# EAGLE design ir_remote_v3 (EAGLE 9.6.2)
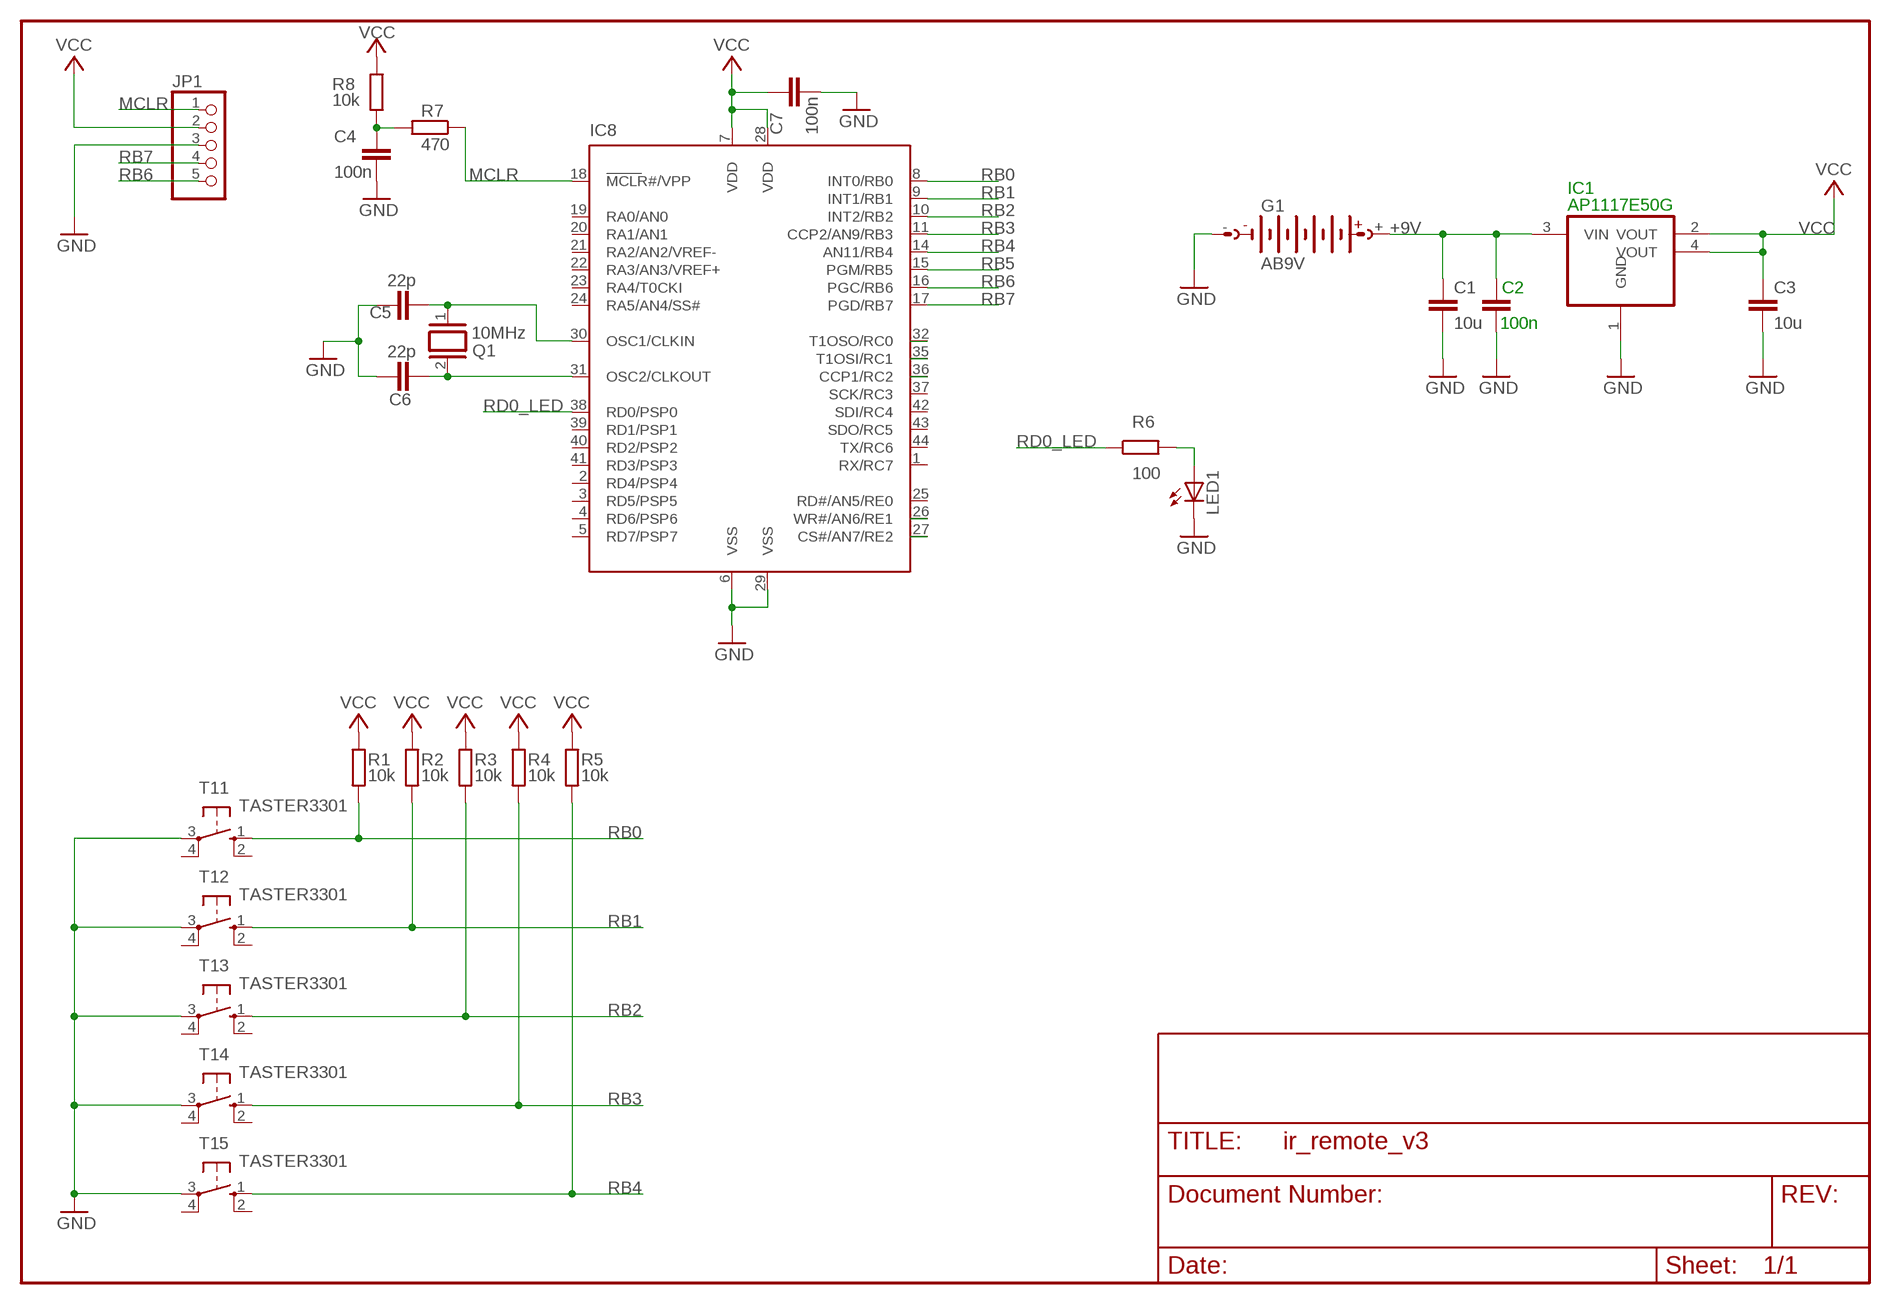
[diagram p0: schematic, sheet 1]

## Parts
C1  10u  C-EUC0805  [C0805]
C2  100n  C-EUC0805  [C0805]
C3  10u  C-EUC0805  [C0805]
C4  100n  C-EUC0805  [C0805]
C5  22p  C-EUC0603_WE  [C0603_WE]
C6  22p  C-EUC0603_WE  [C0603_WE]
C7  100n  C-EUC0805  [C0805]
G1  AB9V  [AB9V]
IC1  AP1117E50G  REG1117-2OUT  [SOT223]
IC8  PIC18F4520  [TQFP44]
JP1  PINHD-1X5  [1X05]
LED1  LED5MM  [LED5MM]
Q1  10MHz  XTAL_HC5032  [QUARZ_HC5032/2]
R1  10k  R-EU_M0805  [M0805]
R2  10k  R-EU_M0805  [M0805]
R3  10k  R-EU_M0805  [M0805]
R4  10k  R-EU_M0805  [M0805]
R5  10k  R-EU_M0805  [M0805]
R6  100  R-EU_M0805  [M0805]
R7  470  R-EU_M0805  [M0805]
R8  10k  R-EU_M0805  [M0805]
T11  TASTER3301  [TASTER3301]
T12  TASTER3301  [TASTER3301]
T13  TASTER3301  [TASTER3301]
T14  TASTER3301  [TASTER3301]
T15  TASTER3301  [TASTER3301]

## Nets
+9V: C1.1 C2.1 G1.+ IC1.3(VIN)
D0_LCD: IC8.27(CS#/AN7/RE2)
D1_LCD: IC8.26(WR#/AN6/RE1)
GND: C1.2 C2.2 C3.2 C4.2 C5.1 C6.1 C7.2 G1.- IC1.1(GND) IC8.6(VSS) IC8.29(VSS) JP1.3 LED1.K(C) T11.3(P) T12.3(P) T13.3(P) T14.3(P) T15.3(P)
MCLR: IC8.18(MCLR#/VPP) JP1.1 R7.1
N$19: LED1.A R6.2
N$24: C4.1 R7.2 R8.2
N$47: C5.2 IC8.30(OSC1/CLKIN) Q1.1
N$48: C6.2 IC8.31(OSC2/CLKOUT) Q1.2
RB0: IC8.8(INT0/RB0) R1.2 T11.1(S)
RB1: IC8.9(INT1/RB1) IC8.35(T1OSI/RC1) R2.2 T12.1(S)
RB2: IC8.10(INT2/RB2) IC8.32(T1OSO/RC0) R3.2 T13.1(S)
RB3: IC8.11(CCP2/AN9/RB3) R4.2 T14.1(S)
RB4: IC8.14(AN11/RB4) R5.2 T15.1(S)
RB5: IC8.15(PGM/RB5)
RB6: IC8.16(PGC/RB6) JP1.5
RB7: IC8.17(PGD/RB7) JP1.4
RD0_LED: IC8.38(RD0/PSP0) R6.1
RDS_INT: IC8.36(CCP1/RC2)
VCC: C3.1 C7.1 IC1.2(VOUT) IC1.4(VOUT) IC8.7(VDD) IC8.28(VDD) JP1.2 R1.1 R2.1 R3.1 R4.1 R5.1 R8.1
Unconnected: IC8.1(RX/RC7) IC8.2(RD4/PSP4) IC8.3(RD5/PSP5) IC8.4(RD6/PSP6) IC8.5(RD7/PSP7) IC8.19(RA0/AN0) IC8.20(RA1/AN1) IC8.21(RA2/AN2/VREF-) IC8.22(RA3/AN3/VREF+) IC8.23(RA4/T0CKI) IC8.24(RA5/AN4/SS#) IC8.25(RD#/AN5/RE0) IC8.37(SCK/RC3) IC8.39(RD1/PSP1) IC8.40(RD2/PSP2) IC8.41(RD3/PSP3) IC8.42(SDI/RC4) IC8.43(SDO/RC5) IC8.44(TX/RC6) T11.2(S1) T11.4(P1) T12.2(S1) T12.4(P1) T13.2(S1) T13.4(P1) T14.2(S1) T14.4(P1) T15.2(S1) T15.4(P1)

## Library data of the parts
C1 C3-C7 = rcl:C-EU: CAPACITOR, European symbol
C2 = rcl_416:C-EU: CAPACITOR, European symbol
G1 = battery:AB9V: 9-V BATTERY CLIP
IC1 = Bernd_110428:REG1117-2OUT: 800mA and 1A Low Dropout (LDO) Positive Regulator 1.8V, 2.5V, 2.85V, 3.3V, 5V, and Adj
IC8 = Bernd:PIC18F4520
JP1 = pinhead:PINHD-1X5: PIN HEADER
LED1 = led:LED: LED OSRAM: - CHIPLED LG R971, LG N971, LY N971, LG Q971, LY Q971, LO R971, LY R971 LH N974, LH R974 LS Q976, LO Q976, LY Q976 LO Q996 - Hyper CHIPLED LW Q18S LB Q993, LB Q99A, LB R99A - SideLED LS A670, LO A670, LY A670, LG A670, LP A670 LB A673, LV A673, LT A673, LW A673 LH A674 LY A675 LS A676, LA A676, LO A676, LY A676, LW A676 LS A679, LY A679, LG A679 - Hyper Micro SIDELED® LS Y876, LA Y876, LO Y876, LY Y876 LT Y87S - SmartLED LW L88C, LW L88S LB L89C, LB L89S, LG L890 LS L89K, LO L89K, LY L89K LS L896, LA L896, LO L896, LY L896 - TOPLED LS T670, LO T670, LY T670, LG T670, LP T670 LSG T670, LSP T670, LSY T670, LOP T670, LYG T670 LG T671, LOG T671, LSG T671 LB T673, LV T673, LT T673, LW T673 LH T674 LS T676, LA T676, LO T676, LY T676, LB T676, LH T676, LSB T676, LW T676 LB T67C, LV T67C, LT T67C, LS T67K, LO T67K, LY T67K, LW E67C LS E67B, LA E67B, LO E67B, LY E67B, LB E67C, LV E67C, LT E67C LW T67C LS T679, LY T679, LG T679 LS T770, LO T770, LY T770, LG T770, LP T770 LB T773, LV T773, LT T773, LW T773 LH T774 LS E675, LA E675, LY E675, LS T675 LS T776, LA T776, LO T776, LY T776, LB T776 LHGB T686 LT T68C, LB T68C - Hyper Mini TOPLED® LB M676 - Mini TOPLED Santana® LG M470 LS M47K, LO M47K, LY M47K Source: http://www.osram.convergy.de LUXEON: - LUMILED® LXK2-PW12-R00, LXK2-PW12-S00, LXK2-PW14-U00, LXK2-PW14-V00 LXK2-PM12-R00, LXK2-PM12-S00, LXK2-PM14-U00 LXK2-PE12-Q00, LXK2-PE12-R00, LXK2-PE12-S00, LXK2-PE14-T00, LXK2-PE14-U00 LXK2-PB12-K00, LXK2-PB12-L00, LXK2-PB12-M00, LXK2-PB14-N00, LXK2-PB14-P00, LXK2-PB14-Q00 LXK2-PR12-L00, LXK2-PR12-M00, LXK2-PR14-Q00, LXK2-PR14-R00 LXK2-PD12-Q00, LXK2-PD12-R00, LXK2-PD12-S00 LXK2-PH12-R00, LXK2-PH12-S00 LXK2-PL12-P00, LXK2-PL12-Q00, LXK2-PL12-R00 Source: www.luxeon.com KINGBRIGHT: KA-3528ASYC Source: www.kingbright.com
Q1 = Bernd:XTAL: 9HT10-32.768KDZF-T RS: 753-7265P Farnell: 2061724
R1-R8 = rcl:R-EU_: RESISTOR, European symbol
T11-T15 = Bernd:TASTER3301

## Board
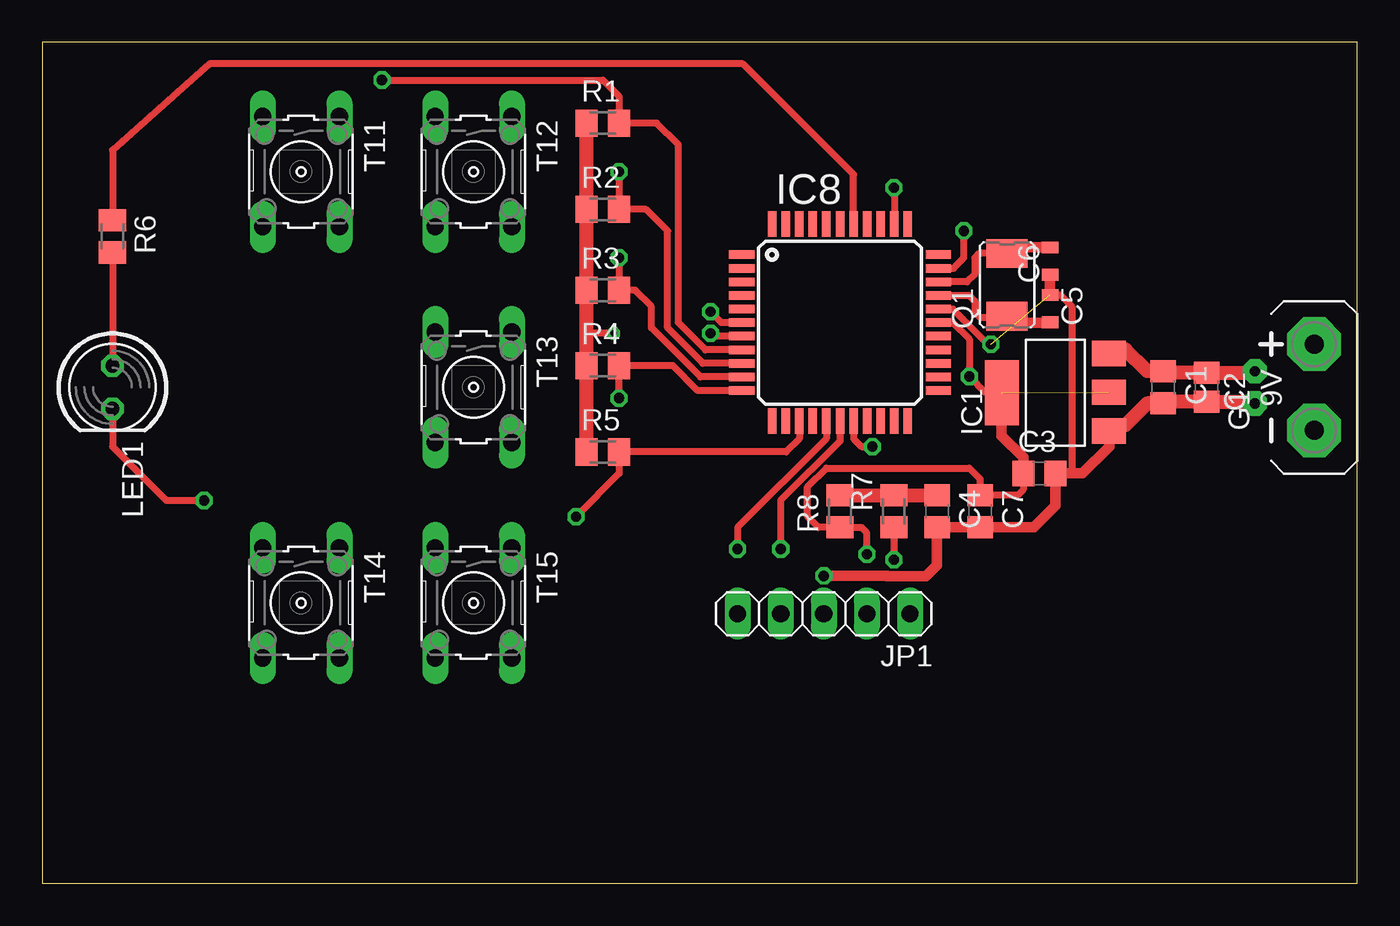
[diagram p1: board, top side]
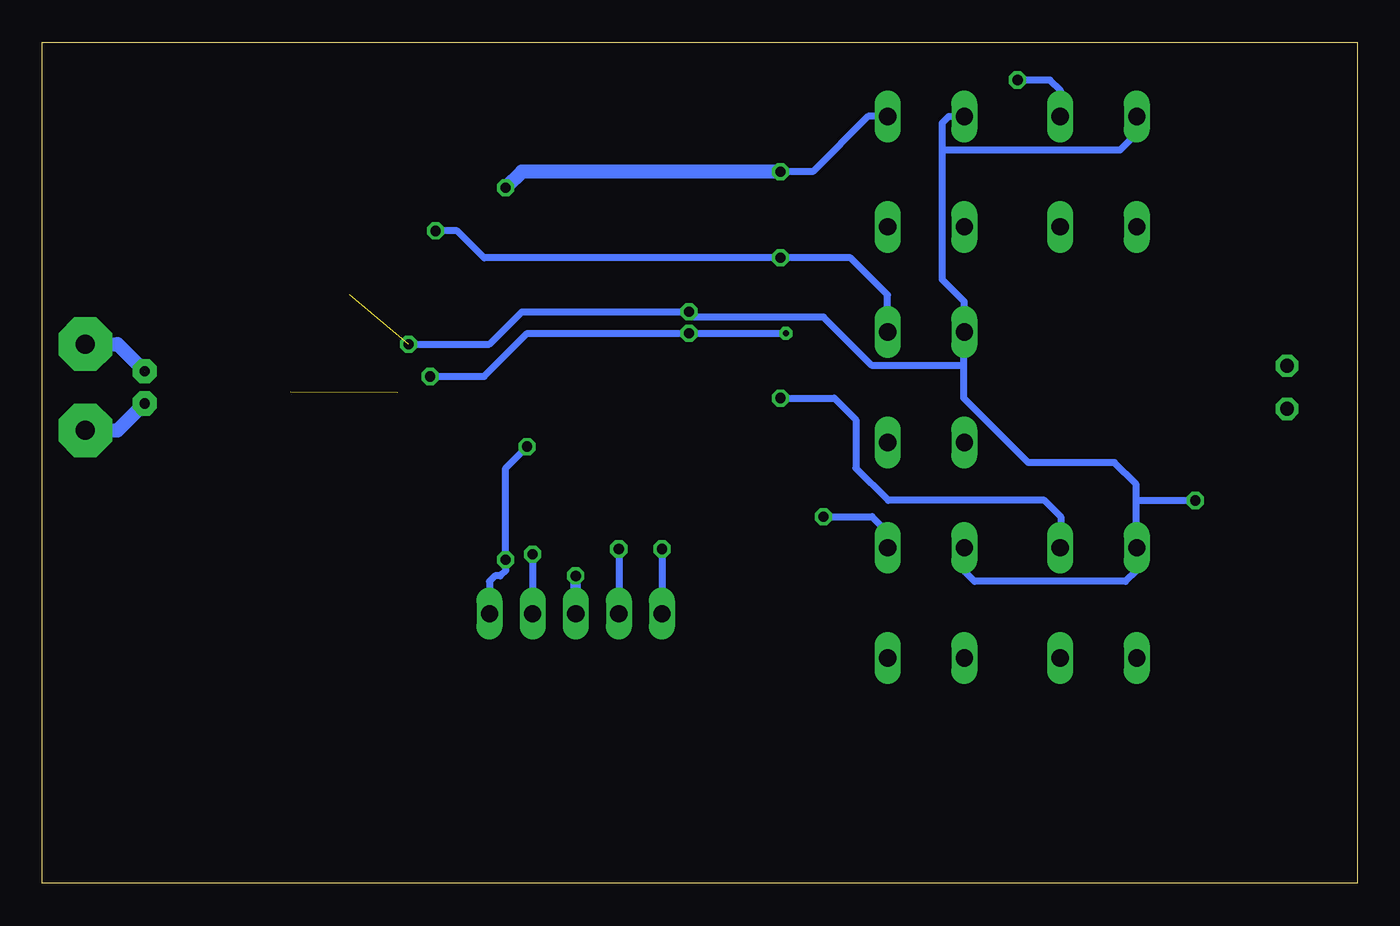
[diagram p2: board, bottom side, seen from below]

Size 77.46 x 49.52 mm. Coordinates in mm from the lower left corner, seen from the top.
Outline: 0,0 77.46,0 77.46,49.52 0,49.52 0,0
Copper layers (1*16): Top 0.035mm / dielectric 1.5mm / Bottom 0.035mm
Design rules "default": minimum track width 6mil, minimum drill 0.35mm, track to track 6mil, track to pad 6mil, pad to pad 6mil, via to via 6mil, smd to smd 6mil, copper to edge 40mil, drill to drill 6mil, minimum pad ring 10mil, minimum via ring 8mil, stop-mask expansion 4mil, vias tented up to drill 0mil, thermal gap 10mil

### Footprints (pad centres in the part's own frame; a part is rotated, then mirrored left to right if it is on the bottom)
C0805 = smd 1.3 x 1.5: 1 -0.95,0; 2 0.95,0
C0805' = smd 1.3 x 1.5: 1 -0.85,0; 2 0.85,0
C0603_WE = smd 0.7 x 1: 1 -0.8,0; 2 0.8,0
AB9V = drill 1.118 pad 3.15 octagon: + 0,2.54; - 0,-2.54
SOT223 = smd 1.499 x 2.007: 1 -2.261,-3.15; 2 0.025,-3.15; 3 2.311,-3.15 | smd 3.81 x 2.007: 4 0,3.15
TQFP44 = smd 1.5 x 0.5: 1 -5.8,4; 2 -5.8,3.2; 3 -5.8,2.4; 4 -5.8,1.6; 5 -5.8,0.8; 6 -5.8,0; 7 -5.8,-0.8; 8 -5.8,-1.6; 9 -5.8,-2.4; 10 -5.8,-3.2; 11 -5.8,-4; 23 5.8,-4; 24 5.8,-3.2; 25 5.8,-2.4; 26 5.8,-1.6; 27 5.8,-0.8; 28 5.8,0; 29 5.8,0.8; 30 5.8,1.6; 31 5.8,2.4; 32 5.8,3.2; 33 5.8,4 | smd 0.5 x 1.5: 12 -4,-5.8; 13 -3.2,-5.8; 14 -2.4,-5.8; 15 -1.6,-5.8; 16 -0.8,-5.8; 17 0,-5.8; 18 0.8,-5.8; 19 1.6,-5.8; 20 2.4,-5.8; 21 3.2,-5.8; 22 4,-5.8; 34 4,5.8; 35 3.2,5.8; 36 2.4,5.8; 37 1.6,5.8; 38 0.8,5.8; 39 0,5.8; 40 -0.8,5.8; 41 -1.6,5.8; 42 -2.4,5.8; 43 -3.2,5.8; 44 -4,5.8
1X05 = drill 1.016 long: 1 -5.08,0; 2 -2.54,0; 3 0,0; 4 2.54,0; 5 5.08,0
LED5MM = drill 0.813 octagon: A -1.27,0; K 1.27,0
QUARZ_HC5032/2 = smd 1.7 x 2.4: 1 -1.85,0; 2 1.85,0
M0805 = smd 1.3 x 1.6: 1 -0.95,0; 2 0.95,0
TASTER3301 = drill 1.016 long: 1 -3.251,2.261; 2 3.251,2.261; 3 -3.251,-2.261; 4 3.251,-2.261

### Placement (x,y rotation side)
C1  66.04,29.21 270 top
C2  100n  [C0805']  68.58,29.21 270 top
C3  58.74,24.13 0 top
C4  52.7,21.91 270 top
C5  59.37,33.85 270 top
C6  59.37,36.64 90 top
C7  55.24,21.91 270 top
G1  74.93,29.21 0 top
IC1  59.69,28.89 90 top
IC8  46.99,33.02 0 top
JP1  46.04,15.88 180 top
LED1  4.13,29.21 270 top
Q1  56.83,35.24 90 top
R1  33.02,44.77 0 top
R2  33.02,39.69 0 top
R3  33.02,34.92 0 top
R4  33.02,30.48 0 top
R5  33.02,25.4 0 top
R6  4.13,38.1 270 top
R7  50.16,21.91 90 top
R8  46.99,21.91 90 top
T11  15.24,41.91 270 top
T12  25.4,41.91 270 top
T13  25.4,29.21 270 top
T14  15.24,16.51 270 top
T15  25.4,16.51 270 top

### Tracks (layer width: path | path; a pad name or v marks a point on that pad's centre or on a via)
+9V  (1 unrouted)
  Top 0.813: 71.44,30.16 71.33,30.06 C2.1 66.14,30.06 C1.1 65.09,30.16 63.82,31.43 63.07,31.43 IC1.3
  Bottom 0.813: G1.+ 73.03,31.75 71.44,30.16
GND  (via drill 0.6, 0.6 pad 1.42)  (1 unrouted)
  Top 0.406: C5.1 59.97,34.65 60.64,33.97 60.64,24.13 | C3.2 | LED1.K 4.13,25.72 7.3,22.54 v9.53,22.54 | IC8.6 40.01,33.02 v39.37,33.66 | v55.88,31.75 55.72,31.75 53.65,33.82 IC8.29
  Top 0.61: C6.1 C5.1 | C3.2 60.64,24.13 61.28,24.13 62.87,25.72 62.87,26.61 IC1.1 | C3.2 59.69,22.23 58.42,20.95 C7.2 C4.2 52.7,18.73 52.06,18.09 49.77,18.09 49.76,18.1 v46.04,18.1
  Top 0.813: v71.44,28.26 71.33,28.36 C2.2 66.14,28.36 C1.2 65.09,28.26 63.82,26.99 63.2,26.99 IC1.1
  Bottom 0.406: 13.02,22.54 v9.53,22.54 | 24.45,43.18 24.45,44.77 24.05,45.16 T12.3 | 24.45,43.18 24.45,35.56 23.14,34.25 T13.3 23.18,32.42 23.18,30.48 | 24.45,43.18 13.97,43.18 12.98,44.17 T11.3 | 13.02,19.8 13.02,22.54 | 13.02,19.8 T14.3 | 13.02,19.8 13.02,18.41 13.65,17.78 22.54,17.78 23.18,18.41 23.18,19.72 T15.3 | 13.02,22.54 13.02,23.5 14.29,24.77 19.37,24.77 23.18,28.57 23.18,30.48 | 23.18,30.48 28.57,30.48 31.43,33.34 39.05,33.34 v39.37,33.66 49.21,33.66 51.12,31.75 v55.88,31.75
  Bottom 0.61: v46.04,18.1 JP1.3
  Bottom 0.813: G1.- 73.03,26.67 v71.44,28.26
MCLR  (via drill 0.6)
  Top 0.406: R7.1 v50.16,19.05 | IC8.18 47.79,26.19 48.26,25.72 v48.9,25.72
  Bottom 0.406: JP1.1 51.12,17.78 50.8,18.1 50.48,18.1 50.16,18.41 v50.16,19.05 50.16,24.45 v48.9,25.72
N$19
  Top 0.406: R6.2 LED1.A
N$24
  Top 0.813: R8.2 R7.2 C4.1
N$47
  Top 0.406: Q1.1 56.78,33.34 55.24,33.34 54.93,33.66 54.93,34.29 54.6,34.62 IC8.30
  Top 0.61: Q1.1 57.41,33.39 57.78,33.02 59.35,33.02 C5.2
N$48
  Top 0.406: 56.78,37.15 Q1.2 55.19,37.09 54.93,36.83 54.93,35.88 54.47,35.42 IC8.31
  Top 0.61: Q1.2 57.41,37.09 57.78,37.47 59.35,37.47 C6.2
RB0  (via drill 0.6)
  Top 0.406: IC8.8 39.06,31.42 37.47,33.02 37.47,43.5 36.2,44.77 R1.2 33.97,46.35 33.02,47.31 v20,47.31
  Bottom 0.406: T11.1 17.46,45.2 17.46,46.67 18.1,47.31 v20,47.31
RB1  (via drill 0.6)
  Top 0.406: IC8.9 38.91,30.62 36.83,32.7 36.83,38.42 35.56,39.69 R2.2 v33.97,41.91 | v50.16,40.96 50.19,40.93 IC8.35
  Bottom 0.406: T12.1 28.82,45.16 32.07,41.91 v33.97,41.91
  Bottom 0.813: v33.97,41.91 49.21,41.91 v50.16,40.96
RB2  (via drill 0.6)
  Top 0.406: IC8.10 38.76,29.82 35.88,32.7 35.88,33.97 34.92,34.92 R3.2 v33.97,36.83 | IC8.32 53.68,36.22 54.29,36.83 v54.29,38.42
  Bottom 0.406: T13.1 27.66,34.65 29.84,36.83 v33.97,36.83 51.44,36.83 53.02,38.42 v54.29,38.42
RB3  (via drill 0.6)
  Top 0.406: IC8.11 38.61,29.02 37.15,30.48 R4.2 v33.97,28.58 v33.97,28.57
  Bottom 0.406: v33.97,28.57 30.8,28.57 29.53,27.3 29.53,24.45 27.62,22.54 18.41,22.54 17.46,21.59 17.46,19.8 T14.1
RB4  (via drill 0.6)
  Top 0.406: IC8.14 44.59,26.18 43.81,25.4 R5.2 33.97,24.15 33.98,24.13 v31.43,21.59
  Bottom 0.406: v31.43,21.59 28.57,21.59 27.62,20.64 27.62,19.8 T15.1
RB6  (via drill 0.6)
  Top 0.406: IC8.16 46.19,26.19 40.96,20.95 v40.96,19.68
  Bottom 0.406: v40.96,19.68 JP1.5
RB7  (via drill 0.6)
  Top 0.406: IC8.17 46.99,26.04 43.5,22.54 v43.5,19.68
  Bottom 0.406: v43.5,19.68 JP1.4
RD0_LED
  Top 0.406: IC8.38 47.79,41.74 41.27,48.26 9.84,48.26 4.13,43.18 R6.1
S$1  (via drill 0.6 pad 1.42)
  other vias: 71.44,30.16
VCC  (via drill 0.35, 0.6)  (1 unrouted)
  Top 0.406: IC8.28 53.66,33.02 54.61,32.07 v54.61,29.84 55.56,28.89 IC1.4 | C3.1 57.79,23.18 57.47,22.86 C7.1 55.24,23.81 54.61,24.45 46.19,24.45 45.09,23.34 45.09,21.59 45.72,20.96 R8.1 48.26,20.96 48.58,20.64 v48.58,19.37 | IC8.7 39.53,32.22 v39.37,32.38 | v33.66,32.38 32.07,32.38
  Top 0.61: IC1.4 56.52,28.87 56.52,26.35 57.79,25.08 C3.1
  Top 0.813: R1.1 R2.1 R3.1 32.07,32.38 R4.1 R5.1
  Bottom 0.406: v48.58,19.37 JP1.2 | v33.66,32.38 v39.37,32.38 48.9,32.38 51.44,29.84 v54.61,29.84